# Altium schematic sheet TEMPLATE_Circuit.SchDoc
size Tabloid; Date: Date; Author: Author 1; Revision: 1; SheetNumber: 5; SheetTotal: 5; Size: 11x17; Sheet_Name: Circuit
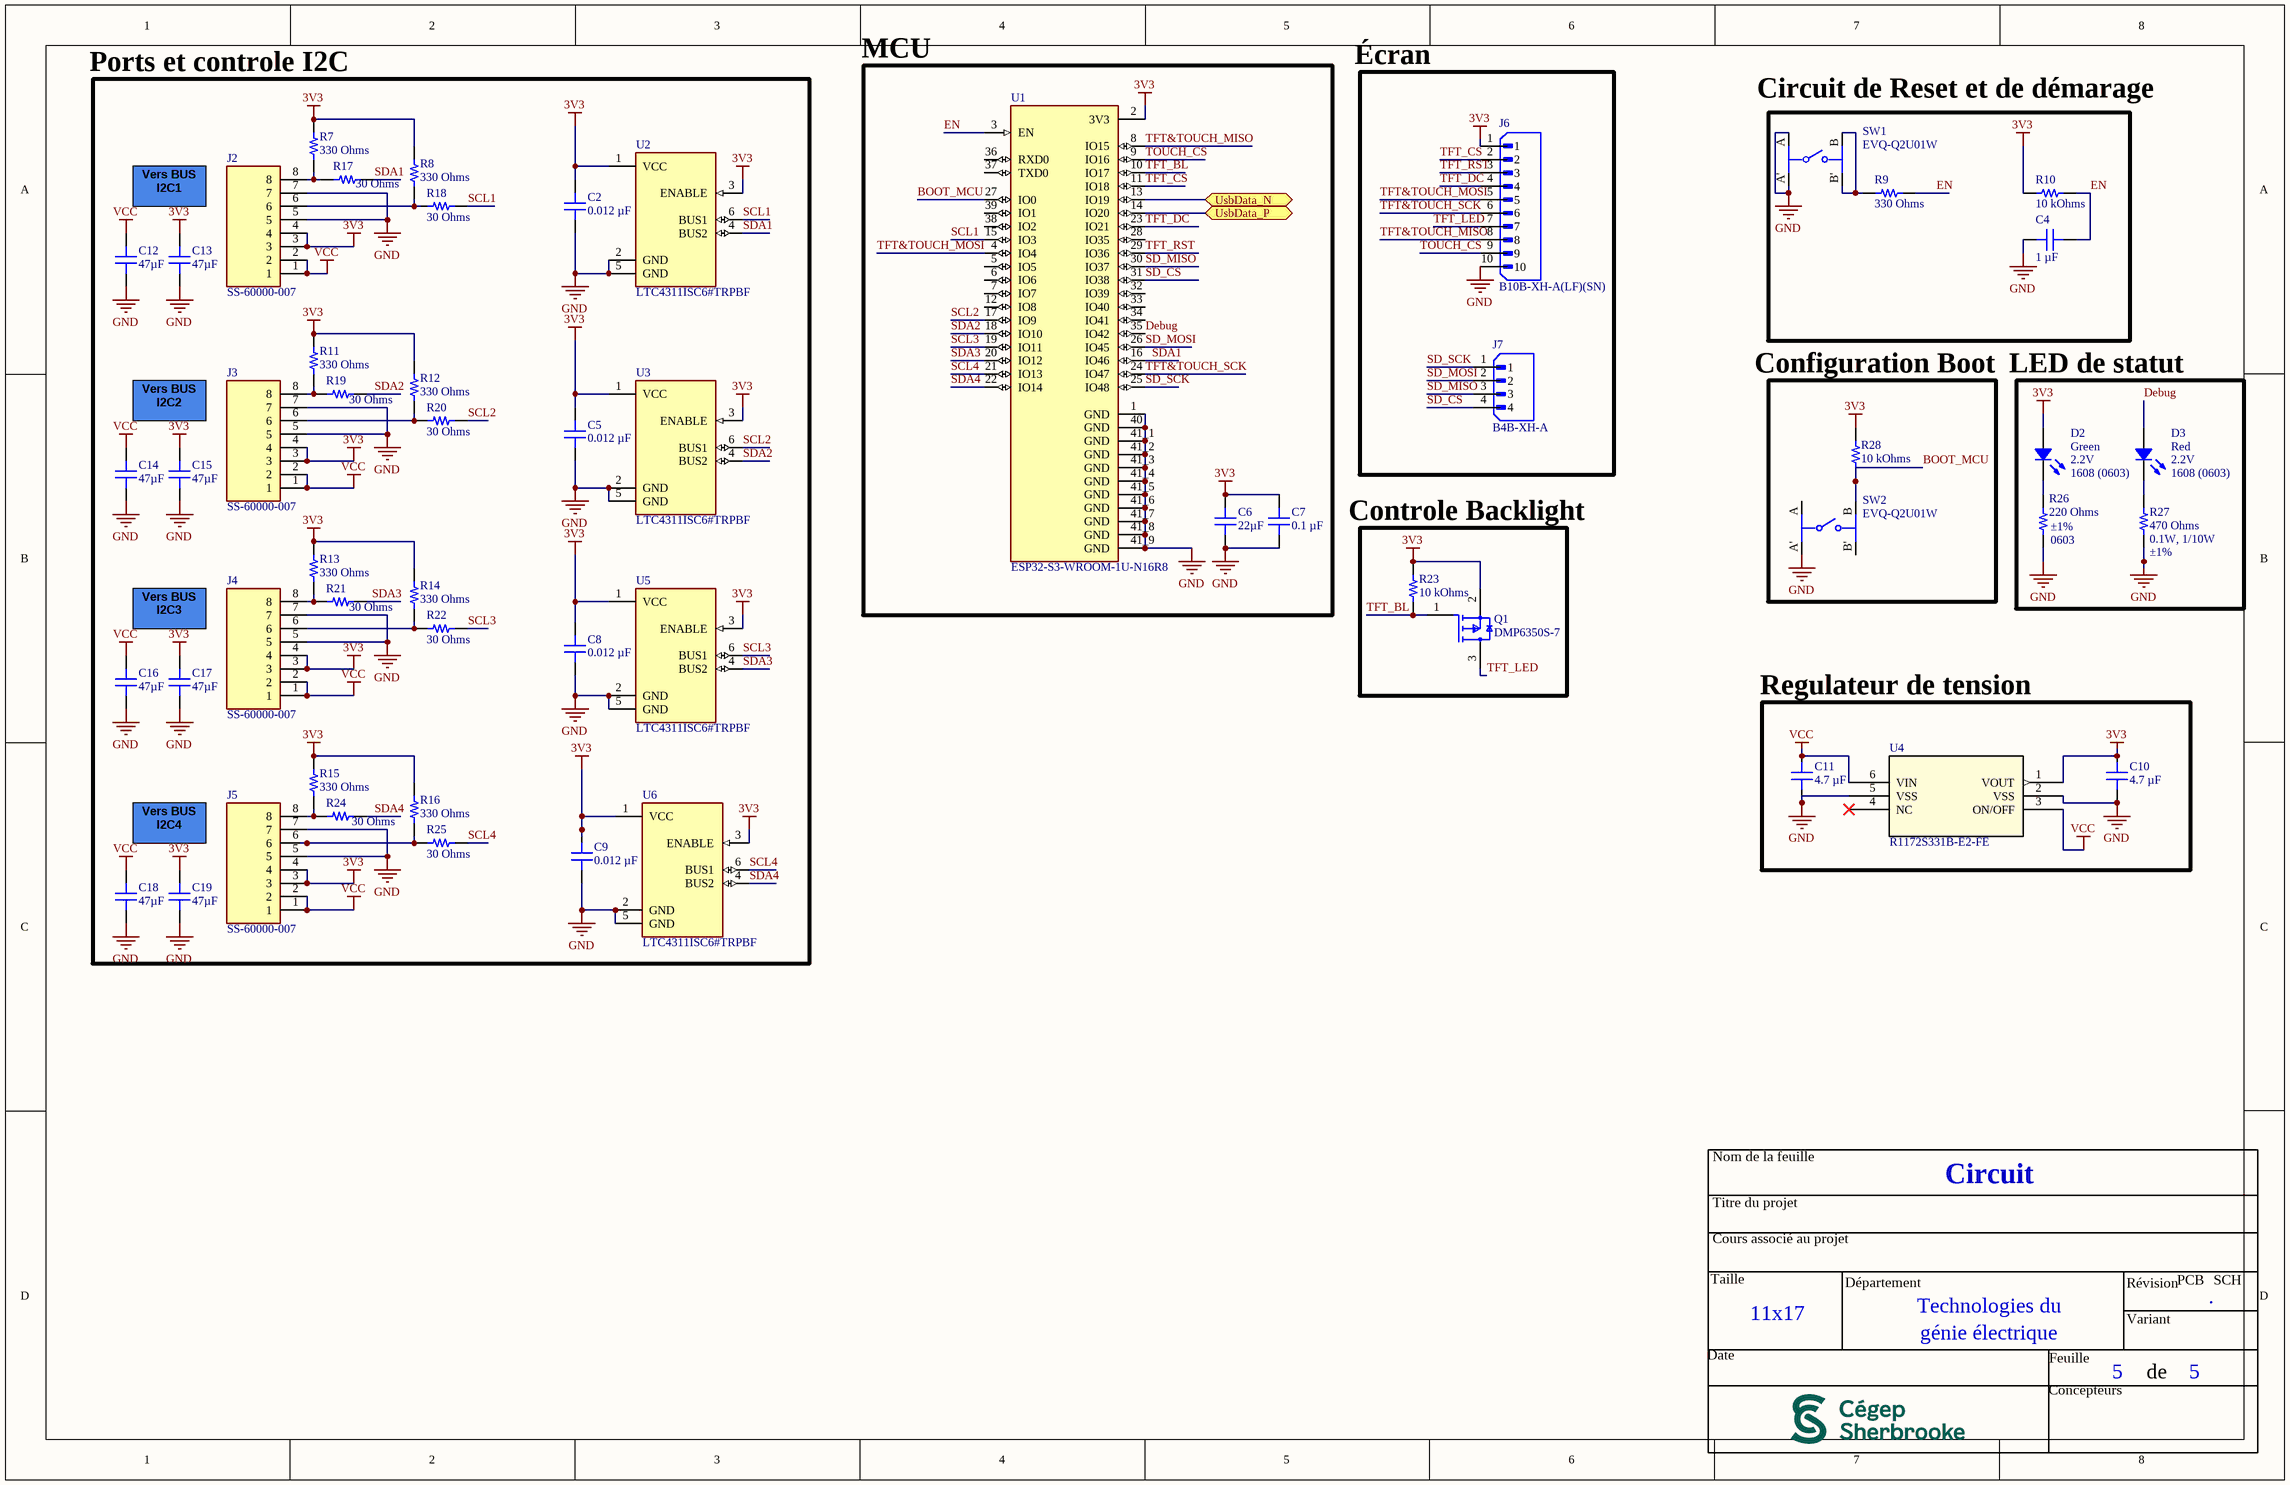
[diagram p0: TEMPLATE_Circuit.SchDoc]

## Parts
C2  0.012 µF  [CAP 0603_1608]
C4  1 µF  [CAP 0603_1608]
C5  0.012 µF  [CAP 0603_1608]
C6  22µF  [CAP 0603_1608]
C7  0.1 µF  [CAP 0603_1608]
C8  0.012 µF  [CAP 0603_1608]
C9  0.012 µF  [CAP 0603_1608]
C10  4.7 µF  [MURATA GRM188 0603_1608]
C11  4.7 µF  [MURATA GRM188 0603_1608]
C12  47µF  [CAP 0603_1608]
C13  47µF  [CAP 0603_1608]
C14  47µF  [CAP 0603_1608]
C15  47µF  [CAP 0603_1608]
C16  47µF  [CAP 0603_1608]
C17  47µF  [CAP 0603_1608]
C18  47µF  [CAP 0603_1608]
C19  47µF  [CAP 0603_1608]
D2  Green  Supplier Device Package: 1608 (0603)  Voltage - Forward (Vf) (Typ): 2.2V  [LED 0603_1608 GREEN]
D3  Red  Supplier Device Package: 1608 (0603)  Voltage - Forward (Vf) (Typ): 2.2V  [LED 0603_1608 RED]
J2  SS-60000-007  [BEL_SS-60000-007]
J3  SS-60000-007  [BEL_SS-60000-007]
J4  SS-60000-007  [BEL_SS-60000-007]
J5  SS-60000-007  [BEL_SS-60000-007]
J6  B10B-XH-A(LF)(SN)  [JST_B10B-XH-A(LF)(SN)]
J7  B4B-XH-A  [JST_B4B-XH-A]
Q1  DMP6350S-7  [FP-SOT23-MFG]
R7  330 Ohms  [RES 0603_1608]
R8  330 Ohms  [RES 0603_1608]
R9  330 Ohms  [RES 0603_1608]
R10  10 kOhms  [RES 0603_1608]
R11  330 Ohms  [RES 0603_1608]
R12  330 Ohms  [RES 0603_1608]
R13  330 Ohms  [RES 0603_1608]
R14  330 Ohms  [RES 0603_1608]
R15  330 Ohms  [RES 0603_1608]
R16  330 Ohms  [RES 0603_1608]
R17  30 Ohms  [RES 0603_1608]
R18  30 Ohms  [RES 0603_1608]
R19  30 Ohms  [RES 0603_1608]
R20  30 Ohms  [RES 0603_1608]
R21  30 Ohms  [RES 0603_1608]
R22  30 Ohms  [RES 0603_1608]
R23  10 kOhms  [RES 0603_1608]
R24  30 Ohms  [RES 0603_1608]
R25  30 Ohms  [RES 0603_1608]
R26  Supplier Device Package: 0603  Tolerance: ±1%  [RES 0603_1608]  (hidden comment: 220 Ohms)
R27  Power (Watts): 0.1W, 1/10W  Tolerance: ±1%  [RES 0603_1608]  (hidden comment: 470 Ohms)
R28  10 kOhms  [RES 0603_1608]
SW1  EVQ-Q2U01W  [FP-EVQ-Q2U01W-MFG]
SW2  EVQ-Q2U01W  [FP-EVQ-Q2U01W-MFG]
U1  ESP32-S3-WROOM-1U-N16R8  [XCVR_ESP32-S3-WROOM-1U-N16R8]
U2  LTC4311ISC6#TRPBF  [SOT65P210X100-6N]
U3  LTC4311ISC6#TRPBF  [SOT65P210X100-6N]
U4  R1172S331B-E2-FE  [HSOP-6_FH006-A-P-SD-2.1_ABL]
U5  LTC4311ISC6#TRPBF  [SOT65P210X100-6N]
U6  LTC4311ISC6#TRPBF  [SOT65P210X100-6N]

## Blocks framed on the sheet
Ports et controle I2C: C2 C5 C8 C9 C12-C19 J2-J5 R7 R8 R11-R22 R24 R25 U2 U3 U5 U6
MCU: C6 C7 U1
Écran: J6 J7
Circuit de Reset et de démarage: C4 R9 R10 SW1
Configuration Boot: R28 SW2
LED de statut: D2 D3 R26 R27
Controle Backlight: Q1 R23
Regulateur de tension: C10 C11 U4

## Ports
UsbData_N (bidir), UsbData_P (bidir)

## Nets
3V3: C2.2 C5.2 C6.2 C7.2 C8.2 C9.2 C10.1 C13.2 C15.2 C17.2 C19.2 D2.1 J2.3 J2.4 J3.3 J3.4 J4.3 J4.4 J5.3 J5.4 J6.1 Q1.2(S) R7.2 R8.2 R10.1 R11.2 R12.2 R13.2 R14.2 R15.2 R16.2 R23.2 R28.1 U1.2(3V3) U2.1(VCC) U2.3(ENABLE) U3.1(VCC) U3.3(ENABLE) U4.1(VOUT) U5.1(VCC) U5.3(ENABLE) U6.1(VCC) U6.3(ENABLE)
GND: C2.1 C4.2 C5.1 C6.1 C7.1 C8.1 C9.1 C10.2 C11.1 C12.1 C13.1 C14.1 C15.1 C16.1 C17.1 C18.1 C19.1 J2.5 J2.7 J3.5 J3.7 J4.5 J4.7 J5.5 J5.7 J6.10 R26.1 R27.1 SW1.A SW1.A' SW2.A' U1.1(GND) U1.40(GND) U1.41_1(GND) U1.41_2(GND) U1.41_3(GND) U1.41_4(GND) U1.41_5(GND) U1.41_6(GND) U1.41_7(GND) U1.41_8(GND) U1.41_9(GND) U2.2(GND) U2.5(GND) U3.2(GND) U3.5(GND) U4.2(VSS) U4.5(VSS) U5.2(GND) U5.5(GND) U6.2(GND) U6.5(GND)
VCC: C11.2 C12.2 C14.2 C16.2 C18.2 J2.1 J2.2 J3.1 J3.2 J4.1 J4.2 J5.1 J5.2 U4.3(ON/OFF) U4.6(VIN)
BOOT_MCU: R28.2 SW2.B U1.27(IO0)
Debug: D3.1 U1.35(IO42)
EN: C4.1 R9.1 R10.2 U1.3(EN)
SCL1: R18.2 U1.15(IO3) U2.6(BUS1)
SCL2: R20.2 U1.17(IO9) U3.6(BUS1)
SCL3: R22.2 U1.19(IO11) U5.6(BUS1)
SCL4: R25.2 U1.21(IO13) U6.6(BUS1)
SD_CS: J7.4 U1.31(IO38)
SD_MISO: J7.3 U1.30(IO37)
SD_MOSI: J7.2 U1.26(IO45)
SD_SCK: J7.1 U1.25(IO48)
SDA1: R17.2 U1.16(IO46) U2.4(BUS2)
SDA2: R19.2 U1.18(IO10) U3.4(BUS2)
SDA3: R21.2 U1.20(IO12) U5.4(BUS2)
SDA4: R24.2 U1.22(IO14) U6.4(BUS2)
TFT&TOUCH_MISO: J6.8 U1.8(IO15)
TFT&TOUCH_MOSI: J6.5 U1.4(IO4)
TFT&TOUCH_SCK: J6.6 U1.24(IO47)
TFT_BL: Q1.1(G) R23.1 U1.10(IO17)
TFT_CS: J6.2 U1.11(IO18)
TFT_DC: J6.4 U1.23(IO21)
TFT_LED: J6.7 Q1.3(D)
TFT_RST: J6.3 U1.29(IO36)
TOUCH_CS: J6.9 U1.9(IO16)
UsbData_N: U1.13(IO19) ; port UsbData_N
UsbData_P: U1.14(IO20) ; port UsbData_P
NetD2_2: D2.2 R26.2
NetD3_2: D3.2 R27.2
NetJ2_6: J2.6 R8.1 R18.1
NetJ2_8: J2.8 R7.1 R17.1
NetJ3_6: J3.6 R12.1 R20.1
NetJ3_8: J3.8 R11.1 R19.1
NetJ4_6: J4.6 R14.1 R22.1
NetJ4_8: J4.8 R13.1 R21.1
NetJ5_6: J5.6 R16.1 R25.1
NetJ5_8: J5.8 R15.1 R24.1
NetR9_2: R9.2 SW1.B SW1.B'

Not connected (* = marked no-connect by the designer): SW2 A B'; U1 5(IO5) 6(IO6) 7(IO7) 12(IO8) 28(IO35) 32(IO39) 33(IO40) 34(IO41) 36(RXD0) 37(TXD0) 38(IO2) 39(IO1); U4 4(NC)*

## Notes on the sheet
- Vers BUS I2C1
- Vers BUS I2C2
- Vers BUS I2C3
- Vers BUS I2C4
- Nom de la feuille
- Titre du projet
- Cours associé au projet
- Taille
- Département
- Technologies du
- Révision
- PCB
- .
- SCH
- Date
- génie électrique
- Feuille
- Variant
- de
- Concepteurs

## Library data of the parts
C2 C5 C8 C9 = CC0603KRX7R7BB123: CAP CER 0.012UF 16V X7R 0603; manufacturer: Yageo; Tolerance: ±10%; Part Number: CC0603KRX7R7BB123; Value: 0.012 µF; Applications: General Purpose; Capacitance: 0.012 µF; componentlink1description: Datasheet; componentlink1url: https://www.yageo.com/upload/media/product/productsearch/datasheet/mlcc/UPY-GPHC_X7R_6.3V-to-50V_18.pdf; componentlink2description: DigiKey Link; componentlink2url: https://www.digikey.com/en/products/detail/yageo/CC0603KRX7R7BB123/5883754; Device Package: 0603 (1608 Metric); lastupdated: 2024-02-09 20:10:17; Lifecycle Status: Active; Minimum Order: 1; Mounting Type: Surface Mount, MLCC; Operating Temperature: -55°C ~ 125°C; Package / Case: 0603 (1608 Metric); packaging: TapeAndReel; partid: 12340; Part Status: Active; price: 0.01; series: CC; Size / Dimension: 0.063" L x 0.031" W (1.60mm x 0.80mm); Supplier 1: DigiKey; Supplier Part Number 1: 311-3370-1-ND; Temperature Coefficient: X7R; Thickness (Max): 0.035" (0.90mm); Voltage - Rated: 16V
C4 = C0603X105M4RACAUTO: CAP CER 1UF 16V X7R 0603; manufacturer: KEMET; Tolerance: ±20%; Part Number: C0603X105M4RACAUTO; Value: 1 µF; Applications: Automotive, Boardflex Sensitive; Capacitance: 1 µF; componentlink1description: Datasheet; componentlink1url: https://api.kemet.com/component-edge/download/datasheet/C0603X105M4RACAUTO.pdf; componentlink2description: DigiKey Link; componentlink2url: https://www.digikey.com/en/products/detail/kemet/C0603X105M4RACAUTO/8635846; Device Package: 0603 (1608 Metric); Features: Soft Termination; lastupdated: 2024-02-09 20:10:28; Lifecycle Status: Active; Minimum Order: 1; Mounting Type: Surface Mount, MLCC; Operating Temperature: -55°C ~ 125°C; Package / Case: 0603 (1608 Metric); packaging: TapeAndReel; partid: 3927; Part Status: Active; price: 0.06; Ratings: AEC-Q200; series: SMD Auto X7R Flex; Size / Dimension: 0.063" L x 0.031" W (1.60mm x 0.80mm); Supplier 1: DigiKey; Supplier Part Number 1: 399-17719-1-ND; Temperature Coefficient: X7R; Thickness (Max): 0.037" (0.95mm); Voltage - Rated: 16V
C6 = 06036D226MAT2A: CAP CER 22UF 6.3V X5R 0603; manufacturer: AVX Corporation; Tolerance: ±20%; Part Number: 06036D226MAT2A; Value: 22µF; Applications: General Purpose; Capacitance: 22µF; componentlink1description: Datasheet; componentlink1url: http://datasheets.avx.com/cx5r.pdf; componentlink2description: DigiKey Link; componentlink2url: http://digikey.com/product-detail/en/avx-corporation/06036D226MAT2A/478-10812-1-ND/7536349; Device Package: 0603 (1608 Metric); lastupdated: 2020-09-02 01:03:16; Lifecycle Status: Active; Minimum Order: 1; Mounting Type: Surface Mount, MLCC; Operating Temperature: -55°C ~ 85°C; Package / Case: 0603 (1608 Metric); packaging: TapeAndReel; partid: 13180; Part Status: Active; price: 0.10; series: -; Size / Dimension: 0.063" L x 0.032" W (1.60mm x 0.81mm); Supplier 1: DigiKey; Supplier Part Number 1: 478-10812-1-ND; Temperature Coefficient: X5R; Thickness (Max): 0.040" (1.02mm); Voltage - Rated: 6.3V
C7 = C0603C104M4RAC7411: CAP CER 0.1UF 16V X7R 0603; manufacturer: KEMET; Tolerance: ±20%; Part Number: C0603C104M4RAC7411; Value: 0.1 µF; Applications: Bypass, Decoupling; Capacitance: 0.1 µF; componentlink1description: Datasheet; componentlink1url: https://api.kemet.com/component-edge/download/datasheet/C0603C104M4RAC7411.pdf; componentlink2description: DigiKey Link; componentlink2url: https://www.digikey.com/en/products/detail/kemet/C0603C104M4RAC7411/1865802; Device Package: 0603 (1608 Metric); lastupdated: 2024-02-09 20:10:25; Lifecycle Status: Active; Minimum Order: 15000; Mounting Type: Surface Mount, MLCC; Operating Temperature: -55°C ~ 125°C; Package / Case: 0603 (1608 Metric); packaging: TapeAndReel; partid: 6660; Part Status: Active; price: 0.01; series: SMD Comm X7R; Size / Dimension: 0.063" L x 0.031" W (1.60mm x 0.80mm); Supplier 1: DigiKey; Supplier Part Number 1: 399-5784-2-ND; Temperature Coefficient: X7R; Thickness (Max): 0.034" (0.87mm); Voltage - Rated: 16V
C10 C11 = GRM188C81C475KE11D: CAP CER 4.7UF 16V X6S 0603; manufacturer: Murata Electronics; Tolerance: ±10%; Part Number: GRM188C81C475KE11D; Value: 4.7 µF; Applications: General Purpose; Capacitance: 4.7 µF; componentlink1description: Datasheet; componentlink1url: https://search.murata.co.jp/Ceramy/image/img/A01X/G101/ENG/GRM188C81C475KE11-01.pdf; componentlink2description: DigiKey Link; componentlink2url: https://www.digikey.com/en/products/detail/murata-electronics/GRM188C81C475KE11D/4905320; Device Package: 0603 (1608 Metric); lastupdated: 2024-07-20 00:23:22; Lifecycle Status: Active; Minimum Order: 1; Mounting Type: Surface Mount, MLCC; Operating Temperature: -55°C ~ 105°C; Package / Case: 0603 (1608 Metric); packaging: TapeAndReel; partid: 2389; Part Status: Active; price: 0.03; series: GRM; Size / Dimension: 0.063" L x 0.031" W (1.60mm x 0.80mm); Supplier 1: DigiKey; Supplier Part Number 1: 490-13362-1-ND; Temperature Coefficient: X6S; Thickness (Max): 0.037" (0.95mm); Voltage - Rated: 16V
C12-C19 = 06036D476MAT2A: CAP CER 47UF 6.3V X5R 0603; manufacturer: AVX Corporation; Tolerance: ±20%; Part Number: 06036D476MAT2A; Value: 47µF; Applications: General Purpose; Capacitance: 47µF; componentlink1description: Datasheet; componentlink1url: http://datasheets.avx.com/cx5r.pdf; componentlink2description: DigiKey Link; componentlink2url: http://digikey.com/product-detail/en/avx-corporation/06036D476MAT2A/478-11180-1-ND/7563130; Device Package: 0603 (1608 Metric); lastupdated: 2020-09-02 01:03:20; Lifecycle Status: Active; Minimum Order: 1; Mounting Type: Surface Mount, MLCC; Operating Temperature: -55°C ~ 85°C; Package / Case: 0603 (1608 Metric); packaging: TapeAndReel; partid: 11014; Part Status: Active; price: 0.41; series: -; Size / Dimension: 0.063" L x 0.031" W (1.60mm x 0.80mm); Supplier 1: DigiKey; Supplier Part Number 1: 478-11180-1-ND; Temperature Coefficient: X5R; Voltage - Rated: 6.3V
D2 = SML-D12P8WT86: LED GREEN DIFFUSED 0603 SMD; Manufacturer: Rohm Semiconductor; Configuration: Standard; Current - Test: 20mA; Lens Color: White; Lens Size: 1.20mm x 0.80mm; Lens Style: Rectangle with Flat Top; Millicandela Rating: 6.3mcd; Wavelength - Dominant: 560nm; Part Number: SML-D12P8WT86; Color: Green; ComponentLink1Description: Datasheet; ComponentLink1URL: https://www.rohm.com/datasheet/SML-D12V8W; ComponentLink2Description: DigiKey Link; ComponentLink2URL: https://www.digikey.com/en/products/detail/rohm-semiconductor/SML-D12P8WT86/1641798; Device Package: 0603 (1608 Metric); Height (Max): 0.65mm; LastUpdated: 9/26/2023 8:24:57 PM; Lens Transparency: Diffused; Lifecycle Status: Active; Minimum Order: 1; Mounting Type: Surface Mount; Package / Case: 0603 (1608 Metric); Packaging: TapeAndReel; PartId: 616; Part Status: Active; Price: 0.03; Series: EXCELED™; Size / Dimension: 1.60mm L x 0.80mm W; Supplier 1: DigiKey; Supplier Part Number 1: 511-1579-1-ND; Value: Green
D3 = SML-D12U1WT86: LED RED DIFFUSED 1608 SMD; Manufacturer: Rohm Semiconductor; Configuration: Standard; Current - Test: 20mA; Lens Color: White; Lens Size: 1.20mm x 0.80mm; Lens Style: Rectangle with Flat Top; Millicandela Rating: 63mcd; Wavelength - Dominant: 620nm; Part Number: SML-D12U1WT86; Color: Red; ComponentLink1Description: Datasheet; ComponentLink1URL: https://www.rohm.com/datasheet/SML-D12U1W; ComponentLink2Description: DigiKey Link; ComponentLink2URL: https://www.digikey.com/en/products/detail/rohm-semiconductor/SML-D12U1WT86/5843853; Device Package: 0603 (1608 Metric); Height (Max): 0.65mm; LastUpdated: 9/26/2023 8:25:49 PM; Lens Transparency: Diffused; Lifecycle Status: Active; Minimum Order: 1; Mounting Type: Surface Mount; Package / Case: 0603 (1608 Metric); Packaging: TapeAndReel; PartId: 452; Part Status: Active; Price: 0.02; Series: SML-D12; Size / Dimension: 1.60mm L x 0.80mm W; Supplier 1: DigiKey; Supplier Part Number 1: SML-D12U1WT86CT-ND; Value: Red
J2-J5 = SS-60000-007: Jack Modular Connector 8p8c _RJ45, Ethernet_ Vertical Unshielded Cat6; MF: Stewart Connector; Value: *; Digi-Key_Part_Number: 380-1094-5-ND; Package: None; SnapEDA_Link: https://www.snapeda.com/parts/SS-60000-007/Stewart%20Connector/view-part/2842197/?ref=snap; Digi-Key_Purchase_URL: https://www.digikey.ca/product-detail/en/stewart-connector/SS-60000-007/380-1094-5-ND/1033361?utm_source=snapeda&utm_medium=aggregator&utm_campaign=symbol; MP: SS-60000-007
J6 = B10B-XH-A(LF)(SN): Connector Header Through Hole 10 position 0.098 (2.50mm); MF: JST Sales; SnapEDA_Link: https://www.snapeda.com/parts/B10B-XH-A(LF)(SN)/JST+Sales+America+Inc./view-part/?ref=snap; Package: None; Value: *; MP: B10B-XH-A(LF)(SN); Check_prices: https://www.snapeda.com/parts/B10B-XH-A(LF)(SN)/JST+Sales+America+Inc./view-part/?ref=eda
J7 = B4B-XH-A: MF: {'manufacturer': u'JST Sales America Inc.'}; Package: None; Price: None; Value: *; MP: B4B-XH-A; Availability: Unavailable
Q1 = CMP-12801-000018-2: MOSFET P-CHA 60V 720MW SOT23; Input Capacitance: 206pF; Continuous Drain Current (ID): 1.5A; Rds On Max: 350mR; Max Operating Temperature: 150°C; Min Operating Temperature: -55°C; RoHS Compliant: Yes; Drain to Source Voltage (Vdss): 60V; Max Power Dissipation: 720mW; Mount: Surface Mount; Packaging: Tape and Reel; Case/Package: TO-236-3
R7-R9 R11-R16 = CRGH0603F330R: RES SMD 330 OHM 1% 1/5W 0603; Manufacturer: TE Connectivity Passive Product; Power (Watts): 0.2W, 1/5W; Temperature Coefficient: ±100ppm/°C; Part Number: CRGH0603F330R; Value: 330 Ohms; ComponentLink1Description: Datasheet; ComponentLink1URL: https://www.te.com/commerce/DocumentDelivery/DDEController?Action=srchrtrv&DocNm=1773204-1&DocType=DS&DocLang=English; ComponentLink2Description: DigiKey Link; ComponentLink2URL: https://www.digikey.com/en/products/detail/te-connectivity-passive-product/CRGH0603F330R/5586961; Composition: Thick Film; Device Package: 0603 (1608 Metric); Height - Seated (Max): 0.022" (0.55mm); LastUpdated: 2024-02-09 20:43:33; Lifecycle Status: Active; Minimum Order: 1; Number of Terminations: 2; Operating Temperature: -55°C ~ 155°C; Package / Case: 0603 (1608 Metric); Packaging: TapeAndReel; PartId: 5733; Part Status: Active; Price: 0.01; Resistance: 330 Ohms; Series: CRGH, Neohm; Size / Dimension: 0.063" L x 0.031" W (1.60mm x 0.80mm); Supplier 1: DigiKey; Supplier Part Number 1: A129541CT-ND; Supplier Device Package: 0603; Tolerance: ±1%
R10 R23 R28 = RCS060310K0JNEA: RES SMD 10K OHM 5% 1/4W 0603; Manufacturer: Vishay Dale; Power (Watts): 0.25W, 1/4W; Temperature Coefficient: ±200ppm/°C; Part Number: RCS060310K0JNEA; Value: 10 kOhms; ComponentLink1Description: Datasheet; ComponentLink1URL: http://www.vishay.com/docs/20065/rcse3.pdf; ComponentLink2Description: DigiKey Link; ComponentLink2URL: https://www.digikey.com/en/products/detail/vishay-dale/RCS060310K0JNEA/5866963; Composition: Thick Film; Device Package: 0603 (1608 Metric); Features: Automotive AEC-Q200, Pulse Withstanding; Height - Seated (Max): 0.020" (0.50mm); LastUpdated: 2024-02-09 20:43:35; Lifecycle Status: Active; Minimum Order: 1; Number of Terminations: 2; Operating Temperature: -55°C ~ 155°C; Package / Case: 0603 (1608 Metric); Packaging: TapeAndReel; PartId: 5383; Part Status: Active; Price: 0.01; Ratings: AEC-Q200; Resistance: 10 kOhms; Series: RCS e3; Size / Dimension: 0.061" L x 0.033" W (1.55mm x 0.85mm); Supplier 1: DigiKey; Supplier Part Number 1: 541-2817-1-ND; Supplier Device Package: 0603; Tolerance: ±5%
R17-R22 R24 R25 = ESR03EZPJ300: RES SMD 30 OHM 5% 1/4W 0603; Manufacturer: Rohm Semiconductor; Power (Watts): 0.25W, 1/4W; Temperature Coefficient: ±200ppm/°C; Part Number: ESR03EZPJ300; Value: 30 Ohms; ComponentLink1Description: Datasheet; ComponentLink1URL: https://www.rohm.com/datasheet/ESR01MZPF/esr-e; ComponentLink2Description: DigiKey Link; ComponentLink2URL: https://www.digikey.com/en/products/detail/rohm-semiconductor/ESR03EZPJ300/4051234; Composition: Thick Film; Device Package: 0603 (1608 Metric); Features: Automotive AEC-Q200, Pulse Withstanding; Height - Seated (Max): 0.022" (0.55mm); LastUpdated: 2024-02-09 20:42:51; Lifecycle Status: Active; Minimum Order: 1; Number of Terminations: 2; Operating Temperature: -55°C ~ 155°C; Package / Case: 0603 (1608 Metric); Packaging: TapeAndReel; PartId: 16506; Part Status: Active; Price: 0.01; Ratings: AEC-Q200; Resistance: 30 Ohms; Series: ESR; Size / Dimension: 0.063" L x 0.031" W (1.60mm x 0.80mm); Supplier 1: DigiKey; Supplier Part Number 1: RHM30DCT-ND; Supplier Device Package: 0603; Tolerance: ±5%
R26 = CR0603-FX-2200ELF: RES SMD 220 OHM 1% 1/10W 0603; Manufacturer: Bourns Inc.; Power (Watts): 0.1W, 1/10W; Temperature Coefficient: ±100ppm/°C; Part Number: CR0603-FX-2200ELF; Value: 220 Ohms; ComponentLink1Description: Datasheet; ComponentLink1URL: https://www.bourns.com/docs/Product-Datasheets/CHPREZTR.pdf; ComponentLink2Description: DigiKey Link; ComponentLink2URL: https://www.digikey.com/en/products/detail/bourns-inc/CR0603-FX-2200ELF/3783837; Composition: Thick Film; Device Package: 0603 (1608 Metric); Features: Moisture Resistant; Height - Seated (Max): 0.022" (0.55mm); LastUpdated: 9/20/2023 7:34:32 PM; Lifecycle Status: Active; Minimum Order: 1; Number of Terminations: 2; Operating Temperature: -55°C ~ 155°C; Package / Case: 0603 (1608 Metric); Packaging: CutTape; PartId: 21101; Part Status: Active; Price: 0.01; Resistance: 220 Ohms; Series: CR0603; Size / Dimension: 0.063" L x 0.031" W (1.60mm x 0.80mm); Supplier 1: DigiKey; Supplier Part Number 1: 118-CR0603-FX-2200ELFCT-ND
R27 = ERJ-3EKF4700V: RES SMD 470 OHM 1% 1/10W 0603; Manufacturer: Panasonic Electronic Components; Temperature Coefficient: ±100ppm/°C; Part Number: ERJ-3EKF4700V; Value: 470 Ohms; ComponentLink1Description: Datasheet; ComponentLink1URL: https://industrial.panasonic.com/cdbs/www-data/pdf/RDA0000/AOA0000C304.pdf; ComponentLink2Description: DigiKey Link; ComponentLink2URL: https://www.digikey.com/en/products/detail/panasonic-electronic-components/ERJ-3EKF4700V/1746417; Composition: Thick Film; Device Package: 0603 (1608 Metric); Features: Automotive AEC-Q200; Height - Seated (Max): 0.022" (0.55mm); LastUpdated: 2024-02-09 20:43:34; Lifecycle Status: Active; Minimum Order: 1; Number of Terminations: 2; Operating Temperature: -55°C ~ 155°C; Package / Case: 0603 (1608 Metric); Packaging: TapeAndReel; PartId: 5664; Part Status: Active; Price: 0.01; Ratings: AEC-Q200; Resistance: 470 Ohms; Series: ERJ-3EK; Size / Dimension: 0.063" L x 0.031" W (1.60mm x 0.80mm); Supplier 1: DigiKey; Supplier Part Number 1: P470HCT-ND; Supplier Device Package: 0603
SW1 SW2 = CMP-05618-000050-1: SWITCH TACTILE SPST-NO 0.02A 15V; Mechanical Life: 200000Cycles; Actuator Color: White; Contact Resistance: 100mR; Throw Configuration: SPST; Voltage Rating (AC): 250V; Actuator Length: 0.2mm; Current Rating: 20mA; Switch Travel: 0.25mm; Illumination Type: Non-Illuminated; Actuator Type: Standard; Operating Force: 2.6N; Switch Function: Off-Mom; Packaging: Tape and Reel; Min Operating Temperature: -40°C; Contact Plating: Silver; Max Operating Temperature: 85°C; Max Voltage Rating (DC): 15V; Size: 1.8mm; Mount: Surface Mount; RoHS Compliant: Yes; Orientation: Straight; Electrical Life: 200000Cycles; Lead Free: Lead Free; Case/Package: SMD/SMT; Contact Current Rating: 20mA; Voltage Rating (DC): 15V; Series: EVQQ2; Color: White; Radiation Hardening: No; Termination: SMD/SMT; Package Quantity: 1; Thickness: 1.8mm
U1 = ESP32-S3-WROOM-1U-N16R8: Bluetooth, WiFi 802.11b/g/n, Bluetooth v5.0 Transceiver Module 2.4GHz Antenna Not Included, U.FL Surface Mount; MF: Espressif Systems; Package: None; Price: None; Value: *; SnapEDA_Link: https://www.snapeda.com/parts/ESP32-S3-WROOM-1U-N16R8/Espressif+Systems/view-part/?ref=snap; MP: ESP32-S3-WROOM-1U-N16R8; Availability: Unavailable; Check_prices: https://www.snapeda.com/parts/ESP32-S3-WROOM-1U-N16R8/Espressif+Systems/view-part/?ref=eda
U2 U3 U5 U6 = LTC4311ISC6#TRPBF: Low Voltage I2C/SMBus Accelerator; MF: Analog Devices; SnapEDA_Link: https://www.snapeda.com/parts/LTC4311ISC6%23TRPBF/Analog+Devices/view-part/?ref=snap; Package: SC70-6 Analog Devices; Value: *; MP: LTC4311ISC6#TRPBF; Check_prices: https://www.snapeda.com/parts/LTC4311ISC6%23TRPBF/Analog+Devices/view-part/?ref=eda
U4 = S-1172B33-E6T1U: No Description Available; Mfr_Name: Nisshinbo Micro Devices Inc.; Digi-Key_Part_Number_3: R1172S331B-E2-FE; Digi-Key_Part_Number_2: R1172S331B-E2-FE; Digi-Key_Part_Number_1: R1172S331B-E2-FE; RefDes: RefDes; Type: Type